# EAGLE design SHT21-Breakout-v2 (EAGLE 5.10)
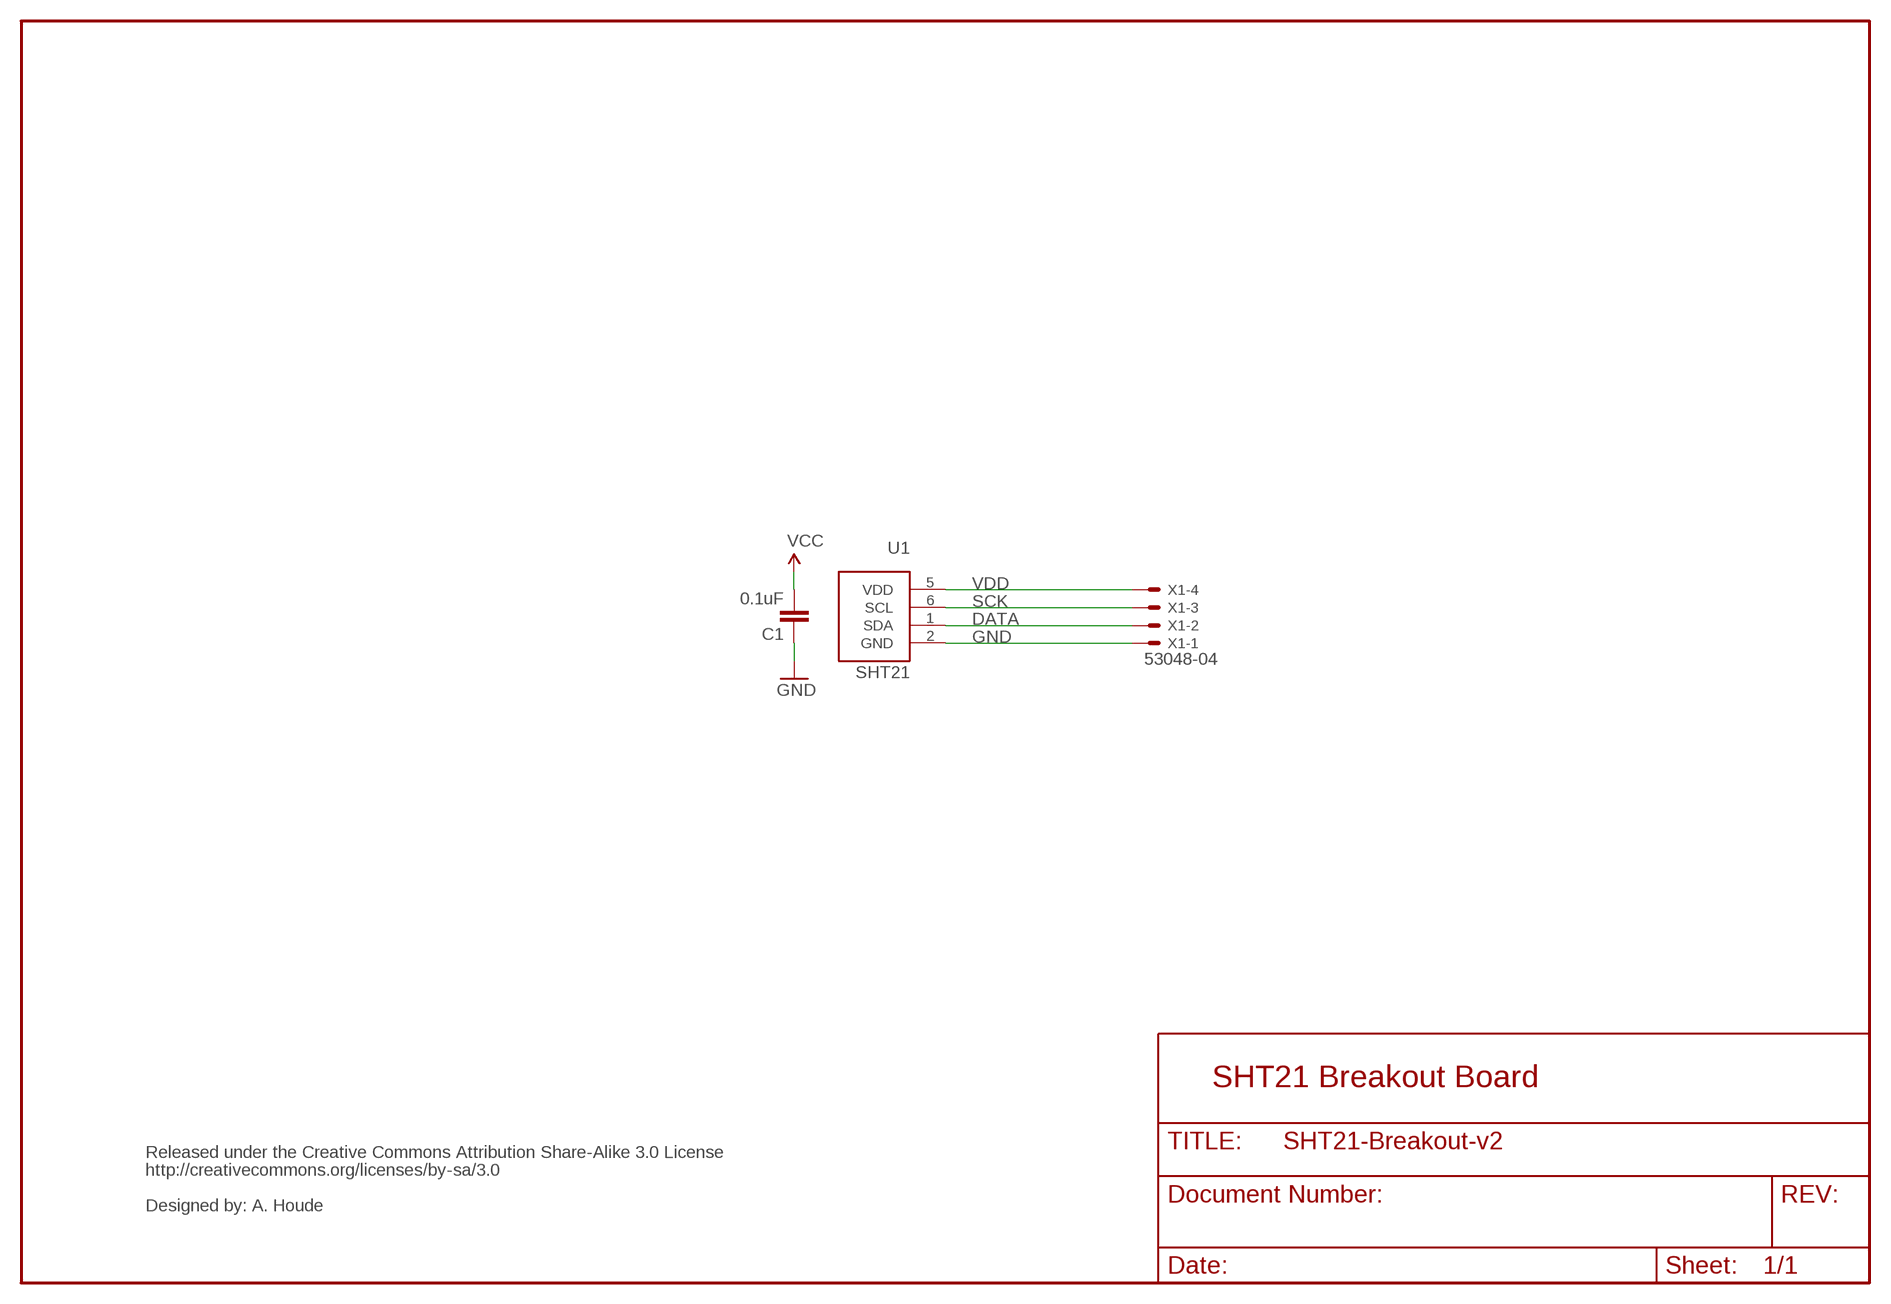
[diagram p0: schematic, sheet 1]

## Parts
C1  0.1uF  CAP0603-CAP  [0603-CAP]
U1  SHT21  [SHT21]
X1  53048-04  [53048-04]

## Nets
DATA: U1.1(SDA) X1.2
GND [power]: C1.1 U1.2(GND) X1.1
SCK: U1.6(SCL) X1.3
VDD: C1.2 U1.5(VDD) X1.4 ; supply symbol labelled VCC

## Notes on the sheet
- SHT21 Breakout Board
- Released under the Creative Commons Attribution Share-Alike 3.0 License
- http://creativecommons.org/licenses/by-sa/3.0
- Designed by: A. Houde

## Library data of the parts
C1 = SparkFun:CAP: Capacitor Standard 0603 ceramic capacitor, and 0.1" leaded capacitor.
U1 = ALX:SHT21
X1 = con-molex:53?-04: CONNECTOR wire to board 1.25 mm (.049 inch) pitch header

## Net classes
0 default: width 0.203 mm
1 power: width 0.305 mm

## Board
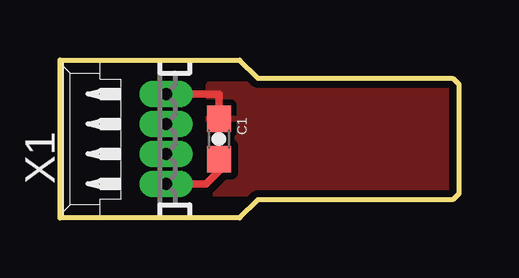
[diagram p1: board, top side]
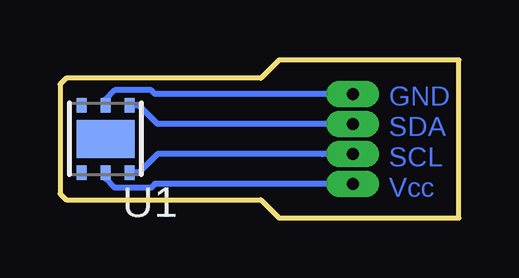
[diagram p2: board, bottom side, seen from below]

Size 16.64 x 6.6 mm. Coordinates in mm from the lower left corner, seen from the top.
Outline: 0,6.6 7.49,6.6 8.25,5.84 16.38,5.84 16.64,5.59 16.64,1.02 16.38,0.76 8.25,0.76 7.49,0 0,0 0,6.6
Copper layers (1*16): Top 0.035mm / dielectric 1.5mm / Bottom 0.035mm
Design rules "SparkFun *": minimum track width 6mil, minimum drill 12mil, track to track 5mil, track to pad 5mil, pad to pad 5mil, via to via 5mil, smd to smd 5mil, copper to edge 9mil, drill to drill 8mil, minimum pad ring 12mil, minimum via ring 10mil, stop-mask expansion 4mil, vias tented up to drill 20mil, thermal gap 10mil

### Footprints (pad centres in the part's own frame; a part is rotated, then mirrored left to right if it is on the bottom)
0603-CAP = smd 1.1 x 1: 1 -0.85,0; 2 0.85,0
SHT21 = smd 0.4 x 0.6: 1 -1,-1.4; 2 0,-1.4; 3 1,-1.4; 4 1,1.4; 5 0,1.4; 6 -1,1.4 | smd 2.4 x 1.6: P$7 0,0
53048-04 = drill 0.5 pad 0.698 long: 1 1.875,-1.25; 2 0.625,-1.25; 3 -0.625,-1.25; 4 -1.875,-1.25

### Placement (x,y rotation side)
C1  6.63,3.3 270 top
U1  14.73,3.3 180 bottom
X1  3.17,3.3 90 top

### Tracks (layer width: path | path; a pad name or v marks a point on that pad's centre or on a via)
DATA
  Bottom 0.254: U1.1 13.34,4.7 12.57,3.94 5.71,3.94 X1.2
GND
  Top 0.305: C1.1 6.63,5.18 X1.1
  Bottom 0.254: U1.2 14.73,4.95 14.35,5.33 12.83,5.33 12.67,5.18 X1.1
  pour Top (isolate 0.305): 6.22,1.02 6.22,5.59 16.38,5.59 16.38,1.02
SCK
  Bottom 0.254: U1.6 13.34,1.9 12.57,2.67 5.71,2.67 X1.3
VDD
  Top 0.305: C1.2 6.63,1.96 6.1,1.43 X1.4
  Bottom 0.254: U1.5 14.73,1.65 14.35,1.27 12.83,1.27 12.67,1.43 X1.4

### Text on the board
Bottom: GND | SDA | SCL | Vcc